# Altium project Drimp_Quadcopter.PrjPcb
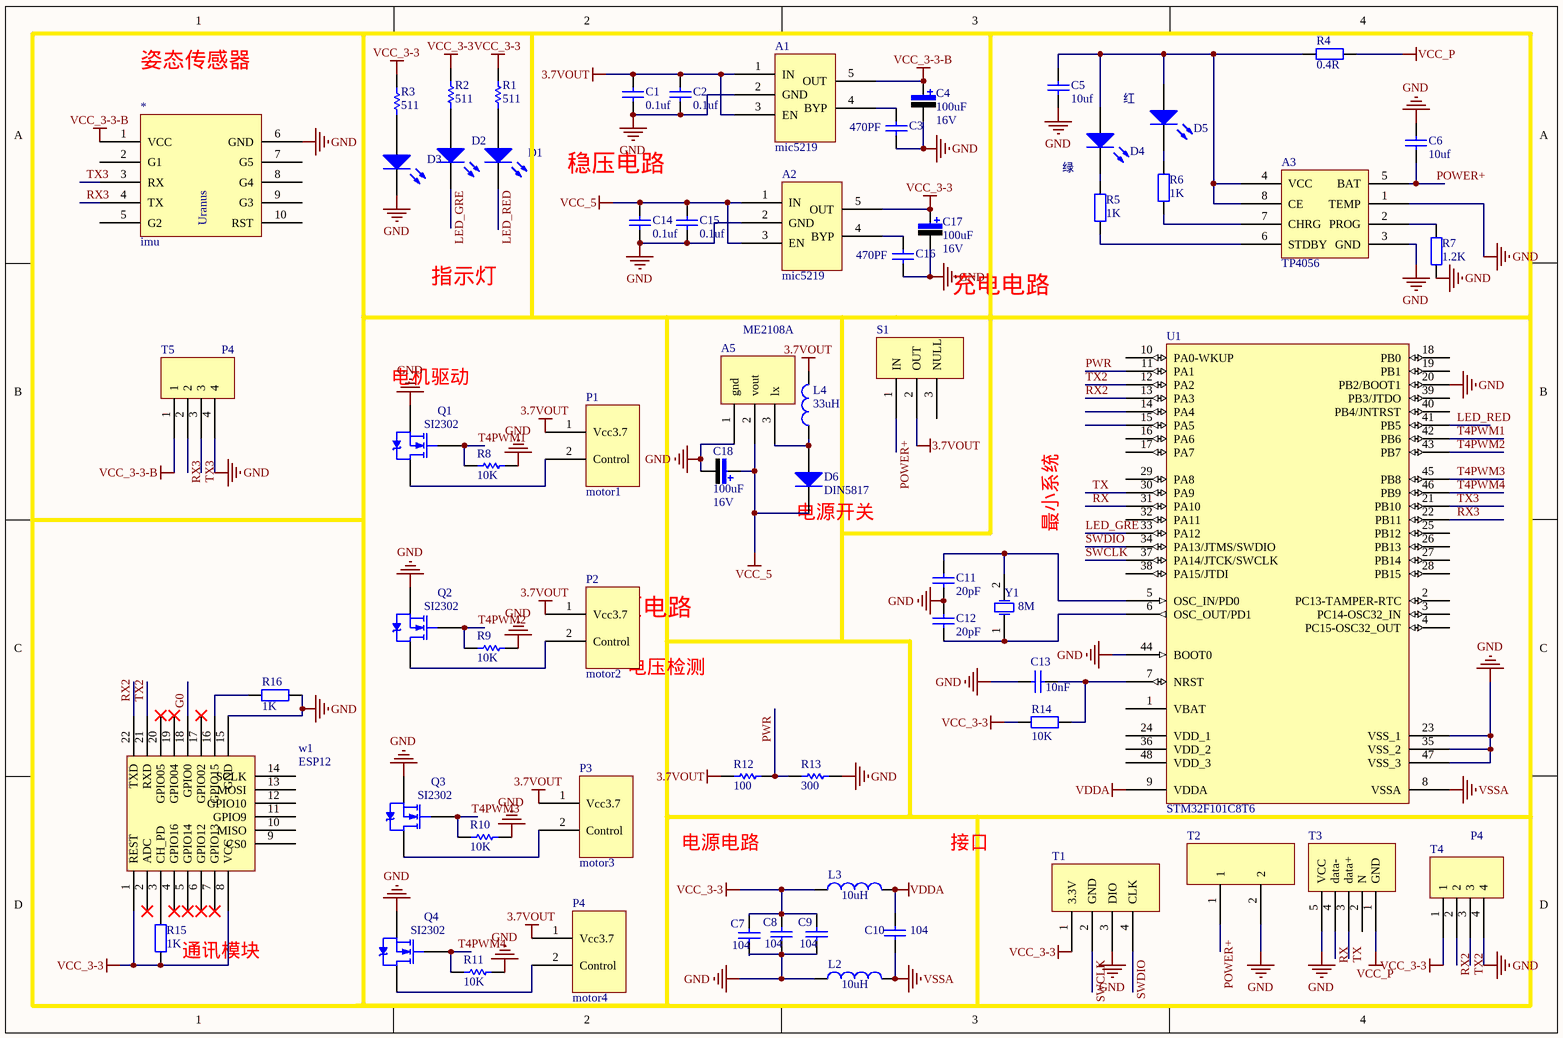
[diagram p0: Drimp_Quadcopter.SchDoc]
1 sheet, 65 parts. Net scope: global (net labels, ports and power ports of the same name join across sheets).
Board file: Drimp_Quadcopter.PcbDoc

## Sheet Drimp_Quadcopter.SchDoc
size A4

### Parts
*  imu  [HI219M]
A1  mic5219  [SOT23-5]
A2  mic5219  [SOT23-5]
A3  TP4056  [SOP8]
A5  ME2108A  [SOT-89_M]
C1  value 0.1uf  [C-RAD-0603]  (hidden comment: Cap)
C2  value 0.1uf  [C-RAD-0603]  (hidden comment: Cap)
C3  value 470PF  [C-RAD-0603]  (hidden comment: Cap)
C4  value 100uF  Vol: 16V  [CAP-6032]  (hidden comment: Cap Pol)
C5  value 10uf  [C-RAD-0603]  (hidden comment: Cap)
C6  value 10uf  [C-RAD-0603]  (hidden comment: Cap)
C7  value 104  [0603-N-CAP]  (hidden comment: Cap)
C8  value 104  [0603-N-CAP]  (hidden comment: Cap)
C9  value 104  [0603-N-CAP]  (hidden comment: Cap)
C10  value 104  [0603-N-CAP]  (hidden comment: Cap)
C11  value 20pF  [0603-N-CAP]  (hidden comment: Cap)
C12  value 20pF  [0603-N-CAP]  (hidden comment: Cap)
C13  value 10nF  [0603-N-CAP]  (hidden comment: Cap)
C14  value 0.1uf  [C-RAD-0603]  (hidden comment: Cap)
C15  value 0.1uf  [C-RAD-0603]  (hidden comment: Cap)
C16  value 470PF  [C-RAD-0603]  (hidden comment: Cap)
C17  value 100uF  Vol: 16V  [CAP-6032]  (hidden comment: Cap Pol)
C18  value 100uF  Vol: 16V  [CAP-6032]  (hidden comment: Cap Pol)
D1  D2  [6-0805_N]  (value not drawn)
D2  D2  [6-0805_N]  (value not drawn)
D3  D2  [6-0805_N]  (value not drawn)
D4  LED0  [LED0805G]  (value not drawn)
D5  LED0  [LED0805R]  (value not drawn)
D6  Type: DIN5817  [DIODE-SMA]  (hidden comment: Diode)
L2  value 10uH  [0603-N - res]  (hidden comment: Inductor)
L3  value 10uH  [0603-N - res]  (hidden comment: Inductor)
L4  value 33uH  [CD54NP]  (hidden comment: Inductor)
P1  motor1  [P2-T-1.25]
P2  motor2  [P2-T-1.25]
P3  motor3  [P2-T-1.25]
P4  motor4  [P2-T-1.25]
Q1  SI2302  [SOT-23_M]
Q2  SI2302  [SOT-23_M]
Q3  SI2302  [SOT-23_M]
Q4  SI2302  [SOT-23_M]
R1  value 511  [0603-N - res]  (hidden comment: Res1)
R2  value 511  [0603-N - res]  (hidden comment: Res1)
R3  value 511  [0603-N - res]  (hidden comment: Res1)
R4  value 0.4R  [1206]  (hidden comment: Res1)
R5  value 1K  [0603-1]  (hidden comment: Res1)
R6  value 1K  [0603-1]  (hidden comment: Res1)
R7  value 1.2K  [0603-1]  (hidden comment: Res1)
R8  value 10K  [0603-N - res]  (hidden comment: Res1)
R9  value 10K  [0603-N - res]  (hidden comment: Res1)
R10  value 10K  [0603-N - res]  (hidden comment: Res1)
R11  value 10K  [0603-N - res]  (hidden comment: Res1)
R12  value 100  [0603-N - res]  (hidden comment: Res1)
R13  value 300  [0603-N - res]  (hidden comment: Res1)
R14  value 10K  [0603-N - res]  (hidden comment: Res2)
R15  value 1K  [0603-N - res]  (hidden comment: Res2)
R16  value 1K  [0603-N - res]  (hidden comment: Res2)
S1  switch  [拨动开关]  (value not drawn)
T1  SW_download  [P4_1.25]  (value not drawn)
T2  P2  [P2]  (value not drawn)
T3  mini usb  [USB_micro_2]  (value not drawn)
T4  P4  [P4_1.25]
T5  P4  [P4_1.25]
U1  STM32F101C8T6  [LQFP48_N]
w1  ESP12  [ESP_12_F]
Y1  8M  [5032_]

### Nets
3.7VOUT: A1.1(IN) A1.3(EN) C1.2 C2.2 L4.2 P1.1(Vcc3.7) P2.1(Vcc3.7) P3.1(Vcc3.7) P4.1(Vcc3.7) R12.1 S1.2(OUT)
GND: *.6(GND) A1.2(GND) A2.2(GND) A3.1(TEMP) A3.3(GND) A5.1(gnd) C1.1 C2.1 C3.1 C4.2 C5.1 C6.2 C7.1 C8.1 C9.1 C11.1 C12.2 C13.1 C14.1 C15.1 C16.1 C17.2 C18.2 D3.2(K) L2.1 Q1.2(S) Q2.2(S) Q3.2(S) Q4.2(S) R7.2 R8.2 R9.2 R10.2 R11.2 R13.2 R16.1 T1.3(DIO) T2.2 T3.5(VCC) T4.4 T5.4 U1.20(PB2/BOOT1) U1.23(VSS_1) U1.35(VSS_2) U1.44(BOOT0) U1.47(VSS_3) w1.15(GND)
VCC_3-3: A2.5(OUT) C7.2 C8.2 C9.2 C17.1 L3.1 R1.2 R2.2 R3.2 R14.1 R15.1 T1.1(3.3V) T4.1 w1.1(REST) w1.8(VCC)
VCC_3-3-B: *.1(VCC) A1.5(OUT) C4.1 T5.1
VCC_5: A2.1(IN) A2.3(EN) A5.2(vout) C14.2 C15.2 C18.1 D6.2(K)
VCC_P: R4.2 T3.1(GND)
VDDA: C10.2 L3.2 U1.9(VDDA)
VSSA: C10.1 L2.2 U1.8(VSSA)
G0: w1.18(GPIO0)
LED_GRE: D2.2(K) U1.33(PA12)
LED_RED: D1.2(K) U1.41(PB5)
POWER+: A3.5(BAT) C6.1 S1.1(IN) T2.1
PWR: R12.2 R13.1 U1.11(PA1)
RX: T3.4(data-) U1.31(PA10)
RX2: T4.2 U1.13(PA3) w1.22(TXD)
RX3: *.4(TX) T5.2 U1.22(PB11)
SWCLK: T1.2(GND) U1.37(PA14/JTCK/SWCLK)
SWDIO: T1.4(CLK) U1.34(PA13/JTMS/SWDIO)
T4PWM1: Q1.1(G) R8.1 U1.42(PB6)
T4PWM2: Q2.1(G) R9.1 U1.43(PB7)
T4PWM3: Q3.1(G) R10.1 U1.45(PB8)
T4PWM4: Q4.1(G) R11.1 U1.46(PB9)
TX: T3.3(data+) U1.30(PA9)
TX2: T4.3 U1.12(PA2) w1.21(RXD)
TX3: *.3(RX) T5.3 U1.21(PB10)
NetA1_4: A1.4(BYP) C3.2
NetA2_4: A2.4(BYP) C16.2
NetA3_2: A3.2(PROG) R7.1
NetA3_4: A3.4(VCC) A3.8(CE) C5.2 D4.1(A) D5.1(A) R4.1
NetA3_6: A3.6(STDBY) R5.2
NetA3_7: A3.7(CHRG) R6.2
NetA5_3: A5.3(lx) D6.1(A) L4.1
NetC11_2: C11.2 U1.5(OSC_IN/PD0) Y1.2(OSC2)
NetC12_1: C12.1 U1.6(OSC_OUT/PD1) Y1.1(OSC1)
NetC13_2: C13.2 R14.2 U1.7(NRST)
NetD1_1: D1.1(A) R1.1
NetD2_1: D2.1(A) R2.1
NetD3_1: D3.1(A) R3.1
NetD4_2: D4.2(K) R5.1
NetD5_2: D5.2(K) R6.1
NetP1_2: P1.2(Control) Q1.3(D)
NetP2_2: P2.2(Control) Q2.3(D)
NetP3_2: P3.2(Control) Q3.3(D)
NetP4_2: P4.2(Control) Q4.3(D)
NetR15_2: R15.2 w1.3(CH_PD)
NetR16_2: R16.2 w1.16(GPIO15)

Not connected (* = marked no-connect by the designer): * 2(G1) 5(G2) 7(G5) 8(G4) 9(G3) 10(RST); S1 3(NULL); T3 2(N); U1 1(VBAT) 2(PC13-TAMPER-RTC) 3(PC14-OSC32_IN) 4(PC15-OSC32_OUT) 10(PA0-WKUP) 14(PA4) 15(PA5) 16(PA6) 17(PA7) 18(PB0) 19(PB1) 24(VDD_1) 25(PB12) 26(PB13) 27(PB14) 28(PB15) 29(PA8) 32(PA11) 36(VDD_2) 38(PA15/JTDI) 39(PB3/JTDO) 40(PB4/JNTRST) 48(VDD_3); w1 2(ADC)* 4(GPIO16)* 5(GPIO14)* 6(GPIO12)* 7(GPIO13)* 9(CS0) 10(MISO) 11(GPIO9) 12(GPIO10) 13(MOSI) 14(SCLK) 17(GPIO02)* 19(GPIO04)* 20(GPIO05)*

### Notes on the sheet
- 姿态传感器
- (near D5) 红
- 稳压电路
- 绿
- 指示灯
- (near R5) 充电电路
- 电机驱动
- 最小系统
- 电源开关
- 升压电路
- 电压检测
- 电源电路
- 接口
- 通讯模块
- (in symbol imu) Uranus

### Library data of the parts
A1 A2 = mic5219: 低压差转3.3V
A5 = bl8530
C1-C3 C5 C6 C14-C16 = Cap: 无极性电容; Published: 8-Jun-2000; LatestRevisionDate: 17-Jul-2002; LatestRevisionNote: Re-released for DXP Platform.; PackageReference: RAD-0.3; Publisher: Altium Limited
C4 C17 C18 = Cap Pol: 极性电解电容; Published: 8-Jun-2000; LatestRevisionDate: 17-Jul-2002; LatestRevisionNote: Re-released for DXP Platform.; PackageReference: RB7.6-15; Publisher: Altium Limited
C7-C13 = Cap: Capacitor; Published: 8-Jun-2000; LatestRevisionDate: 17-Jul-2002; LatestRevisionNote: Re-released for DXP Platform.; PackageReference: RAD-0.3; Publisher: Altium Limited
D1-D3 = LED3: Typical BLUE SiC LED; Published: 8-Jun-2000; LatestRevisionDate: 17-Dec-2003; LatestRevisionNote: PCB Footprint replaced.; DatasheetDocument: 16-Apr-2002; PackageDocument: 16-Apr-2002; PackageReference: 3.5X2.8X1.9; Publisher: Altium Limited
D4 D5 = LED0: 发光二极管; Published: 8-Jun-2000; LatestRevisionDate: 08-Jul-2005; LatestRevisionNote: Mech Layer 1 removed.; PackageReference: LED-0; Publisher: Altium Limited
D6 = Diode: 二极管; Published: 8-Jun-2000; LatestRevisionDate: 17-Jul-2002; LatestRevisionNote: Re-released for DXP Platform.; PackageDocument: Sep-1996; PackageReference: SMC; Publisher: Altium Limited; Code_JEDEC: DO-214-AB
L2 L3 = Inductor: Code_IEC: 1005; Published: 8-Jun-2000; LatestRevisionDate: 17-Jul-2002; LatestRevisionNote: Re-released for DXP Platform.; PackageReference: 0402-A; Publisher: Altium Limited; Code_JEITA: 0402
L4 = Inductor: 电感; Code_IEC: 1005; Published: 8-Jun-2000; LatestRevisionDate: 17-Jul-2002; LatestRevisionNote: Re-released for DXP Platform.; PackageReference: 0402-A; Publisher: Altium Limited; Code_JEITA: 0402
P1-P4 = motor: 电机连接口
Q1-Q4 = IRLML2402: HEXFET Power MOSFET; Published: 8-Jun-2000; LatestRevisionDate: 20-Nov-2009; LatestRevisionNote: IPC-7351 Footprint Added.; DatasheetVersion: Aug-1997; PackageReference: SOT-23; Publisher: Altium Limited; PackageDescription: 3-Pin SOT-23 Package 0.95 mm Pitch, 2.3 mm Lead Span; ComponentLink1Description: Manufacturer Link; ComponentLink1URL: http://www.irf.com/; ComponentLink2Description: Datasheet; ComponentLink2URL: http://www.irf.com/product-info/datasheets/data/irlml2402.pdf
R1-R3 R8-R13 = Res1: Resistor; Published: 8-Jun-2000; LatestRevisionDate: 17-Jul-2002; LatestRevisionNote: Re-released for DXP Platform.; PackageReference: AXIAL-0.3; Publisher: Altium Limited; PackageDescription: Axial Device, Thru-Hole; 2 Leads; 0.3 in Pin Spacing
R4-R7 = Res1: 贴片电阻; Published: 8-Jun-2000; LatestRevisionDate: 17-Jul-2002; LatestRevisionNote: Re-released for DXP Platform.; PackageReference: AXIAL-0.4; Publisher: Altium Limited
R14-R16 = Res2: Resistor; Published: 8-Jun-2000; LatestRevisionDate: 17-Jul-2002; LatestRevisionNote: Re-released for DXP Platform.; PackageReference: AXIAL-0.4; Publisher: Altium Limited
U1 = STM32F101C8T6: STM32 ARM-based 32-bit MCU with 64 Kbytes Flash, 48-pin LQFP, Industrial Temperature; Published: 30-May-2008; DatasheetVersion: rev6, Mar-2008; PackageVersion: Mar-2008; PackageReference: LQFP48; Publisher: Altium Limited; PackageDescription: 48-Pin Low-Profile Quad Flat Pack, 7 x 7 mm Body, 0.5 mm Pitch (LQFP48); ComponentLink1Description: Manufacturer Link; ComponentLink1URL: www.st.com/stm32; ComponentLink2Description: Datasheet; ComponentLink2URL: http://www.st.com/stonline/products/literature/ds/13586.pdf
Y1 = XTAL: Crystal Oscillator; pin to pad: 2>3; Published: 8-Jun-2000; LatestRevisionDate: 17-Jul-2002; LatestRevisionNote: Re-released for DXP Platform.; PackageReference: R38; Publisher: Altium Limited